# EAGLE design truSDX-TCXO-Upgrade-RevB (EAGLE 9.6.2)
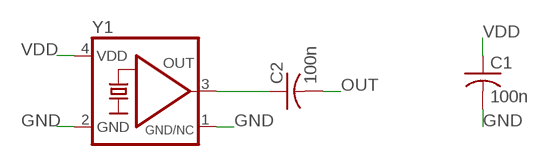
[diagram p0: schematic, sheet 1]

## Parts
C1  100n  C-USC0603  [C0603]
C2  100n  C-USC0603  [C0603]
Y1  KXO-TCXO-CMOS-84  [3.2X2.5_KXO-84-TCXO]

## Nets
GND: C1.2 Y1.1(GND/NC) Y1.2(GND)
N$1: C2.1 Y1.3(OUT)
OUT: C2.2
VDD: C1.1 Y1.4(VDD)

## Library data of the parts
C1 C2 = adafruit:C-US: CAPACITOR, American symbol
Y1 = crystal-geyer_V1_0:KXO-TCXO-CMOS: TCXO : CMOS - Serie Model Size l/w/h [mm] Frequency Range Frequency Stability Temp. Range [°C] Output AECQ 200 availabel Datasheet KXO-86 KXO-84 KXO-83 KXO-82 2.5/2.0/0.7 3.2/2.5/1.0 5.0/3.2/1.5 7.0/5.0/2.4 13,0 ~ 40,0 MHz 10,0 ~ 40,0 MHz 10,0 ~ 40,0 MHz 10,0 ~ 30,0 MHz ±1,0 … ±2,5ppm ±1,0 … ±2,5ppm ±1,0 … ±3,0ppm ±1,0 … ±3,0ppm (*) -30°C …+75°C (*) -40°C …+85°C (*) -40°C …+85°C (*) -30°C …+80°C CMOS CMOS CMOS CMOS - - - - KXO-86.pdf <http://www.geyer-electronic.de/uploads/tx_userartikelfrequenz/GEYER-KXO-86-TCXO-HCMOS.pdf> KXO-84.pdf <http://www.geyer-electronic.de/uploads/tx_userartikelfrequenz/GEYER-KXO-84-TCXO-HCMOS.pdf> KXO-83.pdf <http://www.geyer-electronic.de/uploads/tx_userartikelfrequenz/GEYER-KXO-83-TCXO-HCMOS.pdf> KXO-82.pdf <http://www.geyer-electronic.de/uploads/tx_userartikelfrequenz/GEYER-KXO-82-TCXO-HCMOS.pdf> <http://www.geyer-electronic.de/fileadmin/template/img/logo-geyer-electronic.png> Details see: http://www.geyer-electronic.de/Frequenz-Produkte.9.0.html Created 2016-06-07, Hans Locher 2016 (C) Geyer Quartz Technology KXO86,KXO84,KXO83,KXO82;2550;3225;5032;7050;2,5x2,0;3,2x2,5;2.5x2.0;3.2x2.5,5,0x3,2;7,0x5,0,5.0x3.2,7.0x5.0

## Board
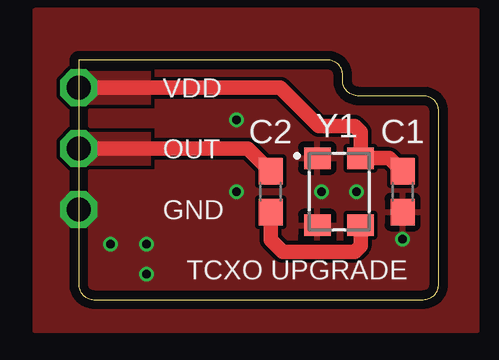
[diagram p1: board, top side]
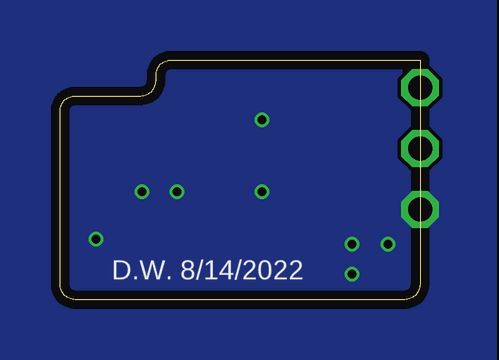
[diagram p2: board, bottom side, seen from below]

Size 15 x 10 mm. Coordinates in mm from the lower left corner, seen from the top.
Outline: 0,10 0,0.64 arc90 0.64,0 14.37,0 arc90 15,0.64 15,7.87 arc90 14.37,8.5 11.63,8.5 arc-90 11,9.13 11,9.37 arc90 10.37,10 0,10
Copper layers (1*16): Top 0.035559375mm / dielectric 1.6mm / Bottom 0.035559375mm
Design rules "oshpark-2layer *": minimum track width 6mil, minimum drill 10mil, track to track 6mil, track to pad 6mil, pad to pad 6mil, via to via 6mil, smd to smd 6mil, copper to edge 15mil, drill to drill 6mil, minimum pad ring 5mil, minimum via ring 5mil, stop-mask expansion 2.5mil, vias tented up to drill 20mil, thermal gap 10mil

### Footprints (pad centres in the part's own frame; a part is rotated, then mirrored left to right if it is on the bottom)
C0603 = smd 1.1 x 1: 1 -0.85,0; 2 0.85,0
3.2X2.5_KXO-84-TCXO = smd 0.9 x 1.1: 1 -1.4,-0.9; 2 1.4,-0.9; 3 1.4,0.9; 4 -1.4,0.9

### Placement (x,y rotation side)
C1  13.5,4.5 270 top
C2  8,4.5 90 top
Y1  10.85,4.5 270 top

### Tracks (layer width: path | path; a pad name or v marks a point on that pad's centre or on a via)
GND  (via drill 0.35, 1 pad 1.55)
  other vias: 0,3.76 11.58,4.5 10.12,4.5 13.5,2.52 6.58,4.5 1.33,2.31 2.83,1.06 2.83,2.31 6.58,7.5
  pour Top (rank 2): -1.81,12.05 -1.81,-1.27 16.59,-1.27 16.59,12.05
  pour Bottom (rank 2): -3.08,13.32 -3.08,-2.54 17.86,-2.54 17.86,13.32
N$1
  Top 0.61: Y1.3 11.75,2.25 11.5,2 8.5,2 8,2.5 C2.1
OUT  (via drill 1 pad 1.55)
  Top 0.61: v0,6.3 7.05,6.3 C2.2
  pour Top (no thermals): 0.25,5.62 3,5.62 3,6.97 0.25,6.97
VDD  (via drill 1 pad 1.55)
  Top 0.61: v0,8.84 8.41,8.84 10,7.25 11.5,7.25 11.75,7 Y1.4 12.95,5.9 C1.1
  pour Top (no thermals): 0.25,8.16 3,8.16 3,9.52 0.25,9.52

### Text on the board
tNames: VDD | OUT | GND | TCXO UPGRADE
bNames: D.W. 8/14/2022